# EAGLE design turbosound28p (EAGLE 9.3.1)
CNAME: Turbosound on DIP28; CREVISION: A; DESIGNER: Andy Karpov
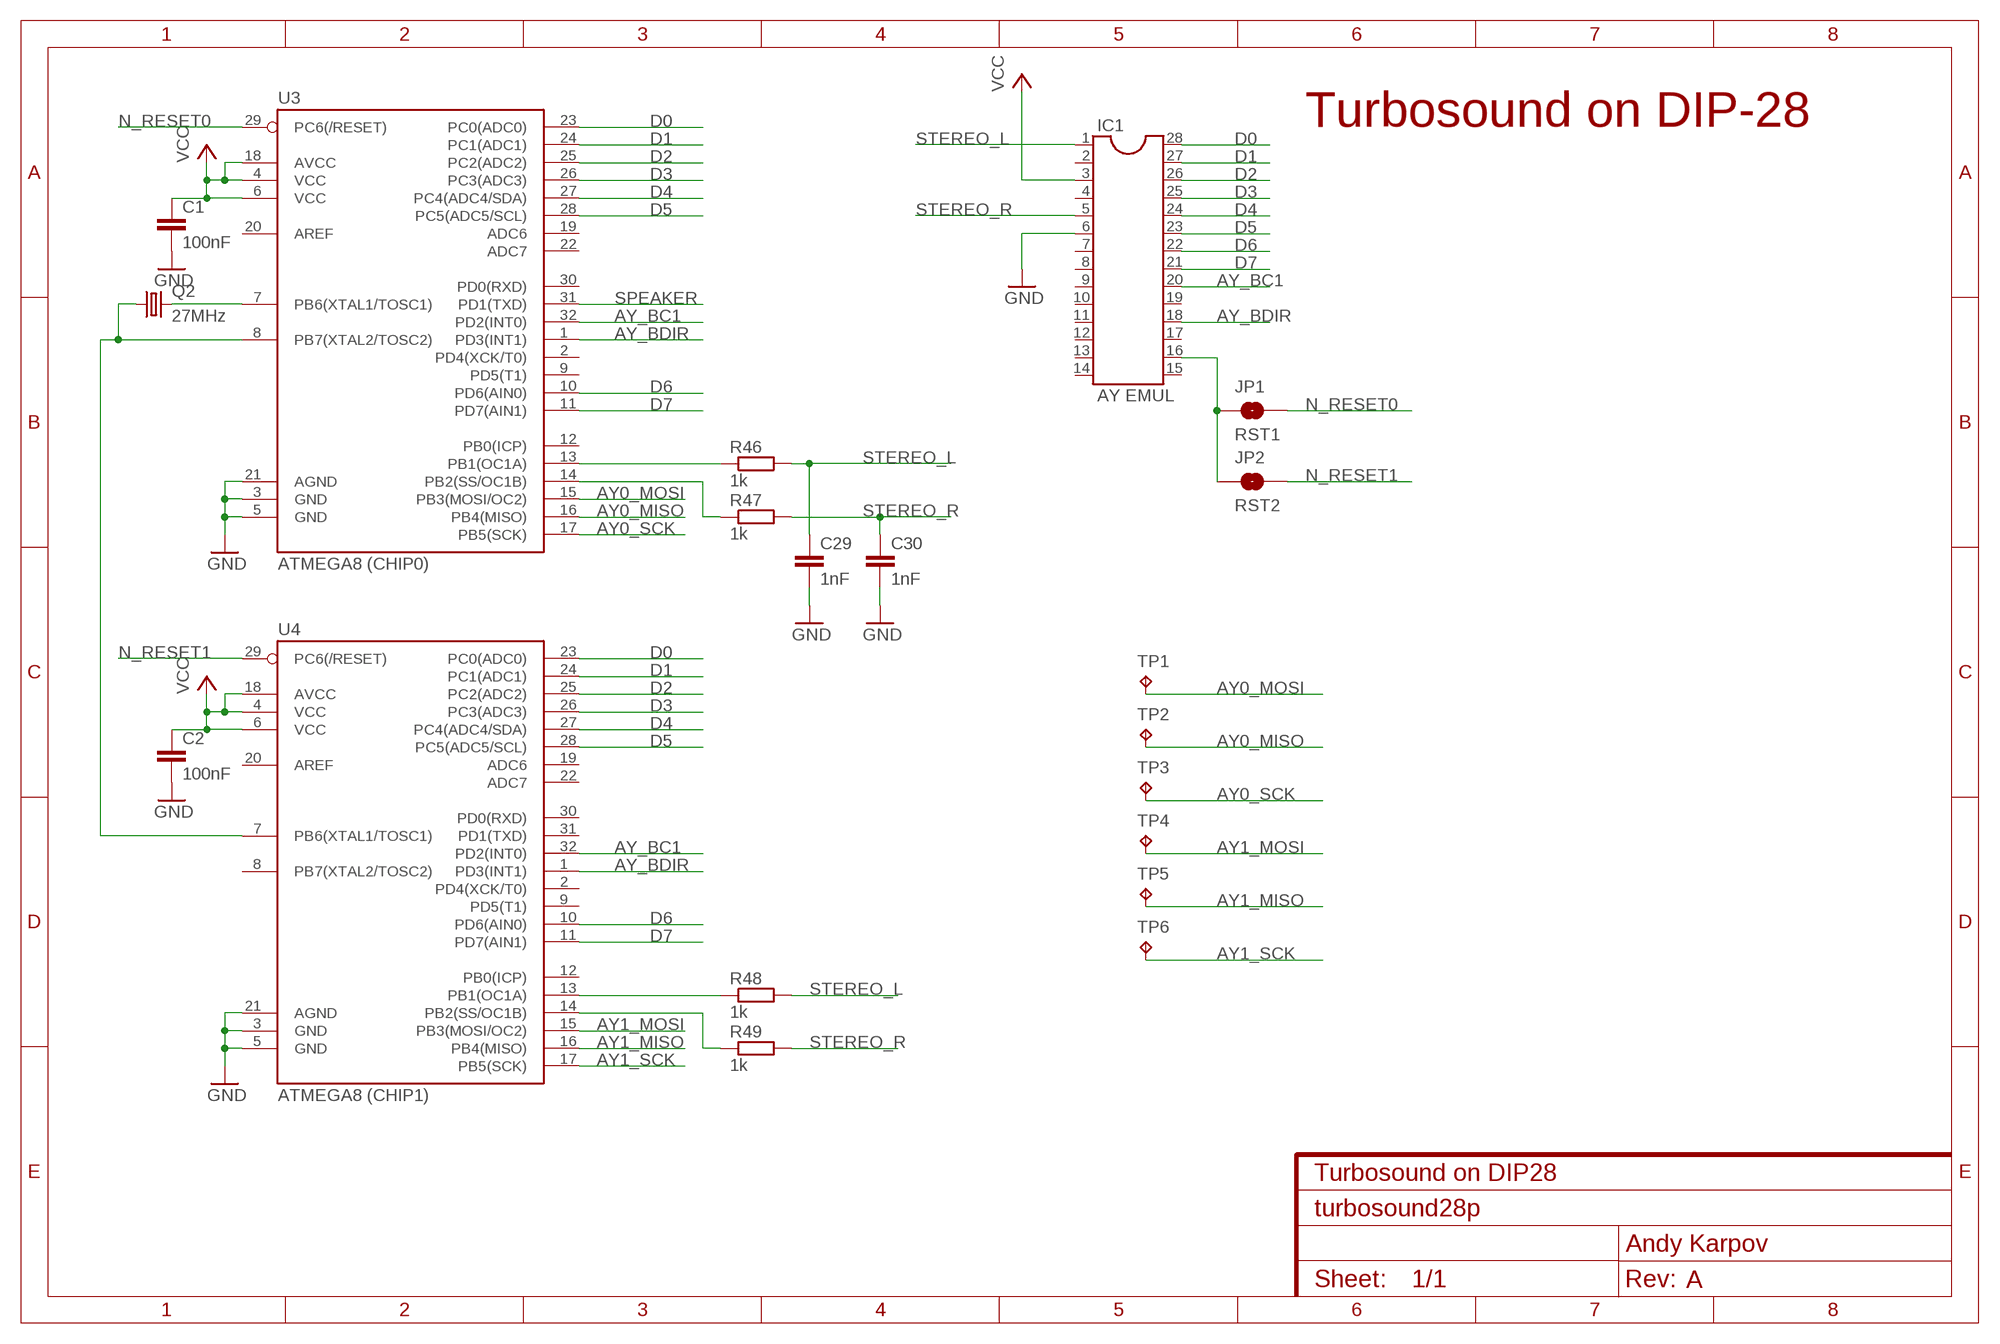
[diagram p0: schematic, sheet 1]

## Parts
C1  100nF  C-EUC0805  [C0805]
C2  100nF  C-EUC0805  [C0805]
C29  1nF  C-EUC0805  [C0805]
C30  1nF  C-EUC0805  [C0805]
IC1  AY EMUL  DIL28  [DIL28-6]
JP1  RST1  JUMPER-SMT_2_NO_SILK  [SMT-JUMPER_2_NO_SILK]
JP2  RST2  JUMPER-SMT_2_NO_SILK  [SMT-JUMPER_2_NO_SILK]
Q2  27MHz  CRYSTALHC49S  [HC49/S]
R46  1k  R-EU_R0805  [R0805]
R47  1k  R-EU_R0805  [R0805]
R48  1k  R-EU_R0805  [R0805]
R49  1k  R-EU_R0805  [R0805]
TP1  TPB1,27  [B1,27]
TP2  TPB1,27  [B1,27]
TP3  TPB1,27  [B1,27]
TP4  TPB1,27  [B1,27]
TP5  TPB1,27  [B1,27]
TP6  TPB1,27  [B1,27]
U3  ATMEGA8 (CHIP0)  ATMEGA328P_TQFP  [TQFP32-08]
U4  ATMEGA8 (CHIP1)  ATMEGA328P_TQFP  [TQFP32-08]

## Nets
AY0_MISO: TP2.TP U3.16(PB4(MISO))
AY0_MOSI: TP1.TP U3.15(PB3(MOSI/OC2))
AY0_SCK: TP3.TP U3.17(PB5(SCK))
AY1_MISO: TP5.TP U4.16(PB4(MISO))
AY1_MOSI: TP4.TP U4.15(PB3(MOSI/OC2))
AY1_SCK: TP6.TP U4.17(PB5(SCK))
AY_BC1: IC1.20 U3.32(PD2(INT0)) U4.32(PD2(INT0))
AY_BDIR: IC1.18 U3.1(PD3(INT1)) U4.1(PD3(INT1))
D0: IC1.28 U3.23(PC0(ADC0)) U4.23(PC0(ADC0))
D1: IC1.27 U3.24(PC1(ADC1)) U4.24(PC1(ADC1))
D2: IC1.26 U3.25(PC2(ADC2)) U4.25(PC2(ADC2))
D3: IC1.25 U3.26(PC3(ADC3)) U4.26(PC3(ADC3))
D4: IC1.24 U3.27(PC4(ADC4/SDA)) U4.27(PC4(ADC4/SDA))
D5: IC1.23 U3.28(PC5(ADC5/SCL)) U4.28(PC5(ADC5/SCL))
D6: IC1.22 U3.10(PD6(AIN0)) U4.10(PD6(AIN0))
D7: IC1.21 U3.11(PD7(AIN1)) U4.11(PD7(AIN1))
GND [power]: C1.2 C2.2 C29.2 C30.2 IC1.6 U3.3(GND) U3.5(GND) U3.21(AGND) U4.3(GND) U4.5(GND) U4.21(AGND)
N$1: IC1.16 JP1.1 JP2.1
N$5: R46.1 U3.13(PB1(OC1A))
N$7: R47.1 U3.14(PB2(SS/OC1B))
N$8: Q2.2 U3.7(PB6(XTAL1/TOSC1))
N$9: Q2.1 U3.8(PB7(XTAL2/TOSC2)) U4.7(PB6(XTAL1/TOSC1))
N$10: R48.1 U4.13(PB1(OC1A))
N$11: R49.1 U4.14(PB2(SS/OC1B))
N_RESET0: JP1.2 U3.29(PC6(/RESET))
N_RESET1: JP2.2 U4.29(PC6(/RESET))
SPEAKER: U3.31(PD1(TXD))
STEREO_L: C29.1 IC1.1 R46.2 R48.2
STEREO_R: C30.1 IC1.5 R47.2 R49.2
VCC [power]: C1.1 C2.1 IC1.3 U3.4(VCC) U3.6(VCC) U3.18(AVCC) U4.4(VCC) U4.6(VCC) U4.18(AVCC)
Unconnected: IC1.2 IC1.4 IC1.7 IC1.8 IC1.9 IC1.10 IC1.11 IC1.12 IC1.13 IC1.14 IC1.15 IC1.17 IC1.19 U3.2(PD4(XCK/T0)) U3.9(PD5(T1)) U3.12(PB0(ICP)) U3.19(ADC6) U3.20(AREF) U3.22(ADC7) U3.30(PD0(RXD)) U4.2(PD4(XCK/T0)) U4.8(PB7(XTAL2/TOSC2)) U4.9(PD5(T1)) U4.12(PB0(ICP)) U4.19(ADC6) U4.20(AREF) U4.22(ADC7) U4.30(PD0(RXD)) U4.31(PD1(TXD))

## Notes on the sheet
- Turbosound on DIP-28

## Library data of the parts
C1 C2 C29 C30 = karabas_box:C-EU: CAPACITOR, European symbol
IC1 = ic-package:DIL28: Dual In Line
JP1 JP2 = SparkFun-Jumpers:JUMPER-SMT_2_NO: Normally open jumper This jumper has two pads in close proximity to each other. Apply solder to close the connection. Round pads are easier to solder for beginners, but are a lot larger. SparkFun Product that uses the round pads: SparkFun EL Sequencer <https://www.sparkfun.com/products/12781>
Q2 = karabas_box:CRYSTAL: CRYSTAL; OC_FARNELL: 1667008; OC_NEWARK: unknown
R46-R49 = karabas_box:R-EU_: RESISTOR, European symbol
TP1-TP6 = testpad:TP: Test pad
U3 U4 = SparkFun-IC-Microcontroller:ATMEGA328P_TQFP: Popular 328P in QFP Storefront component: ATmega328 - TQFP <https://www.sparkfun.com/products/13448> (COM-13448) Datasheet <http://www.sparkfun.com/datasheets/Components/SMD/ATMega328.pdf> SparkFun Products SparkFun RedBoard - Programmed with Arduino <https://www.sparkfun.com/products/12757> (DEV-12757) Arduino Pro Mini 328 - 5V/16MHz <https://www.sparkfun.com/products/11113> (DEV-11113) Arduino Pro Mini 328 - 3.3V/8MHz <https://www.sparkfun.com/products/11114> (DEV-11114) SparkFun OpenLog <https://www.sparkfun.com/products/13712> (DEV-13712) SparkFun MicroView - OLED Arduino Module <https://www.sparkfun.com/products/12923> (DEV-12923) SparkFun Digital Sandbox <https://www.sparkfun.com/products/12651> (DEV-12651) SparkFun PicoBoard <https://www.sparkfun.com/products/11888> (WIG-11888) Arduino Fio <https://www.sparkfun.com/products/10116> (DEV-10116) LilyPad Arduino 328 Main Board <https://www.sparkfun.com/products/13342> (DEV-13342) SparkFun RedStick <https://www.sparkfun.com/products/13741> (DEV-13741) LilyPad MP3 <https://www.sparkfun.com/products/11013> (DEV-11013) LilyPad Arduino SimpleSnap <https://www.sparkfun.com/products/10941> (DEV-10941) SparkFun Stepoko <https://www.sparkfun.com/products/13899> (ROB-13899) SparkFun Geiger Counter <https://www.sparkfun.com/products/11345> (SEN-11345) SparkFun EL Sequencer <https://www.sparkfun.com/products/12781> (COM-12781) Arduino Pro 328 - 5V/16MHz <https://www.sparkfun.com/products/10915> (DEV-10915) CryptoCape <https://www.sparkfun.com/products/12773> (DEV-12773) SparkFun IR Thermometer Evaluation Board - MLX90614 <https://www.sparkfun.com/products/10740> (SEN-10740) SparkFun RedBot Mainboard <https://www.sparkfun.com/products/12097> (ROB-12097) Arduino Pro 328 - 3.3V/8MHz <https://www.sparkfun.com/products/10914> (DEV-10914) SparkFun Block for Intel® Edison - Arduino <https://www.sparkfun.com/products/13036> (DEV-13036) SparkFun Simon Says - Surface Mount Soldering Kit <https://www.sparkfun.com/products/10935> (KIT-10935) SparkFun 7-Segment Serial Display - Red <https://www.sparkfun.com/products/11441> (COM-11441) SparkFun 7-Segment Serial Display - White <https://www.sparkfun.com/products/11629> (COM-11629) SparkFun 7-Segment Serial Display - Yellow <https://www.sparkfun.com/products/11443> (COM-11443) SparkFun 7-Segment Serial Display - Kelly Green <https://www.sparkfun.com/products/11440> (COM-11440) SparkFun 7-Segment Serial Display - Blue <https://www.sparkfun.com/products/11442> (COM-11442) SparkFun OpenSegment Serial Display - 20mm (Blue) <https://www.sparkfun.com/products/11647> (COM-11647) SparkFun OpenSegment Serial Display - 20mm (Green) <https://www.sparkfun.com/products/11646> (COM-11646) SparkFun OpenSegment Serial Display - 20mm (White) <https://www.sparkfun.com/products/11648> (COM-11648) SparkFun OpenSegment Serial Display - 20mm (Red) <https://www.sparkfun.com/products/11644> (COM-11644) SparkFun OpenSegment Serial Display - 20mm (Yellow) <https://www.sparkfun.com/products/11645> (COM-11645) SparkFun OpenSegment Shield <https://www.sparkfun.com/products/13190> (DEV-13190); PROD_ID: IC-09069; VALUE: ATMEGA328P_TQFP

## Net classes
0 default: width 0.178 mm, clearance 0.178 mm
1 power: width 0.305 mm, clearance 0.178 mm to class 0, clearance 0.229 mm

## Board
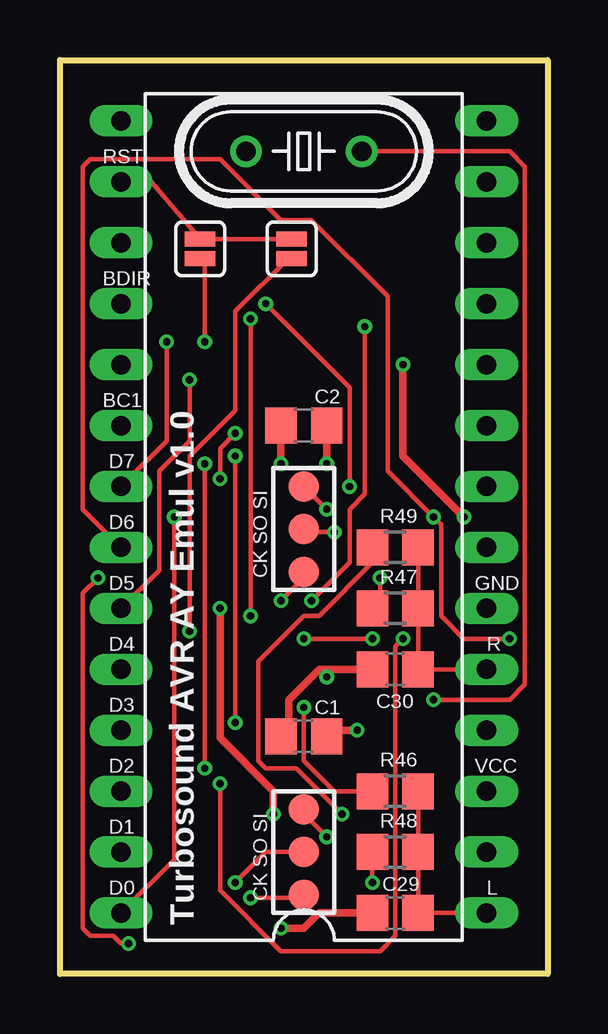
[diagram p1: board, top side]
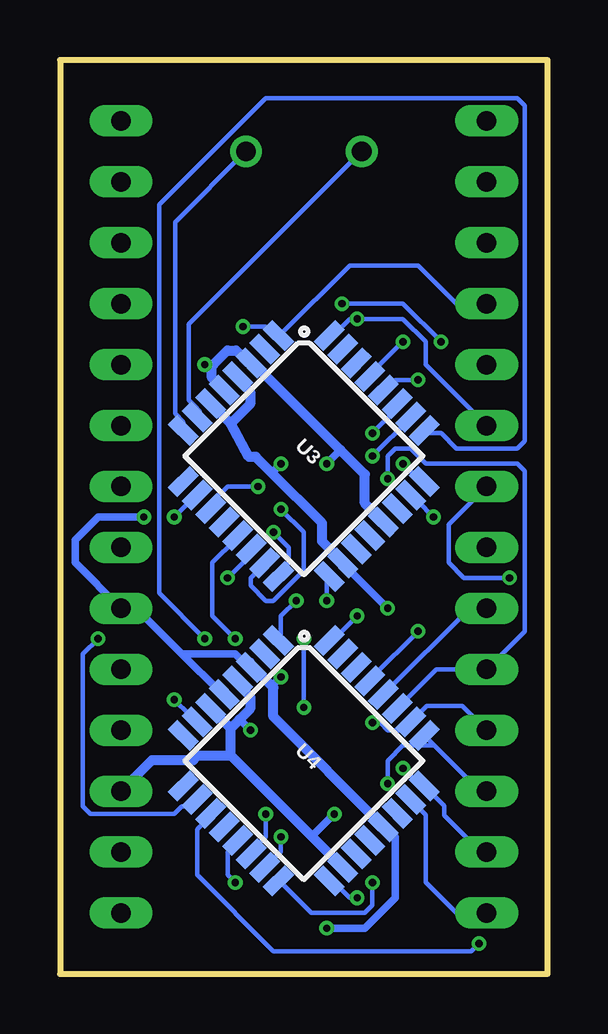
[diagram p2: board, bottom side, seen from below]

Size 20.32 x 38.1 mm. Coordinates in mm from the lower left corner, seen from the top.
Outline: 0,38.1 20.32,38.1 20.32,0 0,0 0,38.1
Copper layers (1*16): Top 0.035mm / dielectric 1.5mm / Bottom 0.035mm
Design rules "default": minimum track width 6mil, minimum drill 12mil, track to track 6mil, track to pad 6mil, pad to pad 6mil, via to via 6mil, smd to smd 0mil, copper to edge 10mil, drill to drill 10mil, minimum pad ring 10mil, minimum via ring 6mil, stop-mask expansion 2mil, vias tented up to drill 100mil, thermal gap 10mil

### Footprints (pad centres in the part's own frame; a part is rotated, then mirrored left to right if it is on the bottom)
C0805 = smd 1.3 x 1.5: 1 -0.95,0; 2 0.95,0
DIL28-6 = drill 0.813 long: 1 -16.51,-7.62; 2 -13.97,-7.62; 3 -11.43,-7.62; 4 -8.89,-7.62; 5 -6.35,-7.62; 6 -3.81,-7.62; 7 -1.27,-7.62; 8 1.27,-7.62; 9 3.81,-7.62; 10 6.35,-7.62; 11 8.89,-7.62; 12 11.43,-7.62; 13 13.97,-7.62; 14 16.51,-7.62; 15 16.51,7.62; 16 13.97,7.62; 17 11.43,7.62; 18 8.89,7.62; 19 6.35,7.62; 20 3.81,7.62; 21 1.27,7.62; 22 -1.27,7.62; 23 -3.81,7.62; 24 -6.35,7.62; 25 -8.89,7.62; 26 -11.43,7.62; 27 -13.97,7.62; 28 -16.51,7.62
SMT-JUMPER_2_NO_SILK = smd 0.635 x 1.27: 1 -0.406,0; 2 0.406,0
HC49/S = drill 0.813: 1 -2.413,0; 2 2.413,0
R0805 = smd 1.3 x 1.5: 1 -0.95,0; 2 0.95,0
B1,27 = smd 1.27 x 1.27: TP 0,0
TQFP32-08 = smd 1.27 x 0.559: 1 -4.293,2.8; 2 -4.293,2; 3 -4.293,1.2; 4 -4.293,0.4; 5 -4.293,-0.4; 6 -4.293,-1.2; 7 -4.293,-2; 8 -4.293,-2.8; 17 4.293,-2.8; 18 4.293,-2; 19 4.293,-1.2; 20 4.293,-0.4; 21 4.293,0.4; 22 4.293,1.2; 23 4.293,2; 24 4.293,2.8 | smd 0.559 x 1.27: 9 -2.8,-4.293; 10 -2,-4.293; 11 -1.2,-4.293; 12 -0.4,-4.293; 13 0.4,-4.293; 14 1.2,-4.293; 15 2,-4.293; 16 2.8,-4.293; 25 2.8,4.293; 26 2,4.293; 27 1.2,4.293; 28 0.4,4.293; 29 -0.4,4.293; 30 -1.2,4.293; 31 -2,4.293; 32 -2.8,4.293

### Placement (x,y rotation side)
C1  10.16,9.91 180 top
C2  10.16,22.86 180 top
C29  13.97,2.54 180 top
C30  13.97,12.7 180 top
IC1  10.16,19.05 90 top
JP1  5.84,30.23 270 top
JP2  9.65,30.23 270 top
Q2  10.16,34.29 180 top
R46  13.97,7.62 0 top
R47  13.97,15.24 0 top
R48  13.97,5.08 0 top
R49  13.97,17.78 0 top
TP1  10.16,20.32 0 top
TP2  10.16,18.54 0 top
TP3  10.16,16.76 0 top
TP4  10.16,6.86 0 top
TP5  10.16,5.08 0 top
TP6  10.16,3.3 0 top
U3  10.16,21.59 315 bottom
U4  10.16,8.89 315 bottom

### Tracks (layer width: path | path; a pad name or v marks a point on that pad's centre or on a via)
AY0_MISO  (via drill 0.3)
  Top 0.178: v11.43,18.41 10.16,18.41 TP2.TP
  Bottom 0.178: v11.43,18.41 10.79,17.78 10.79,17.14 11.11,16.83 U3.16
AY0_MOSI  (via drill 0.3)
  Top 0.178: v11.11,19.37 TP1.TP
  Bottom 0.178: v11.11,19.37 10.16,18.41 10.16,16.83 11.43,15.56 11.75,15.56 12.38,16.19 12.38,16.51 12.06,16.83 U3.15
AY0_SCK  (via drill 0.3)
  Top 0.178: v9.21,15.56 10.16,16.51 TP3.TP
  Bottom 0.178: v9.21,15.56 9.21,16.51 U3.17
AY1_MISO  (via drill 0.3)
  Top 0.178: TP5.TP 8.57,5.08 v7.3,3.81
  Bottom 0.178: v7.3,3.81 7.3,2.86 7.62,2.54 9.84,2.54 11.11,3.81 U4.16
AY1_MOSI  (via drill 0.3)
  Top 0.178: v11.11,5.71 10.16,6.67 TP4.TP
  Bottom 0.178: v11.11,5.71 11.11,5.08 11.75,4.45 U4.15
AY1_SCK  (via drill 0.3)
  Top 0.178: v7.94,3.17 10.16,3.17 TP6.TP
  Bottom 0.178: v7.94,3.17 8.26,3.17 8.89,3.81 U4.17
AY_BC1  (via drill 0.3)
  Top 0.178: v7.94,27.3 v7.94,14.92
  Bottom 0.178: v7.94,14.92 8.89,13.97 U4.32 | U3.32 8.89,26.67 8.26,27.3 v7.94,27.3 6.03,27.3 5.08,26.35 5.08,25.4 IC1.20
AY_BDIR  (via drill 0.3)
  Top 0.178: v10.48,15.56 12.06,17.14 12.06,19.37 12.7,20 v12.7,26.99
  Bottom 0.178: v10.48,15.56 11.11,14.92 11.11,13.97 U4.1 | v12.7,26.99 11.75,26.99 11.43,26.67 U3.1 11.11,26.67 8.26,29.53 5.4,29.53 3.81,27.94 IC1.18
D0  (via drill 0.3)
  Top 0.178: v4.76,19.05 4.76,4.76 IC1.28
  Bottom 0.178: U4.23 5.08,6.64 5.08,3.81 3.81,2.54 IC1.28 | v4.76,19.05 5.4,19.68 U3.23
D1  (via drill 0.3)
  Top 0.178: v6.03,8.57 v6.03,21.27
  Bottom 0.178: IC1.27 2.79,5.08 4.32,6.6 4.32,7.01 U4.24 5.4,7.94 v6.03,8.57 | v6.03,21.27 5.4,20.64 U3.24
D2  (via drill 0.3)
  Top 0.178: v14.29,13.97 13.97,13.65 13.97,1.59 13.34,0.95 9.21,0.95 6.67,3.49 v6.67,7.94
  Bottom 0.178: U4.25 4.74,9.54 | 4.74,9.54 2.82,7.62 IC1.26 | v14.29,13.97 16.19,15.88 16.19,32.07 11.75,36.51 1.27,36.51 0.95,36.2 0.95,22.23 1.27,21.91 3.81,21.91 4.45,22.54 5.08,22.54 U3.25 | v6.67,7.94 6.67,8.89 6.03,9.53 4.76,9.53 4.74,9.54
D3  (via drill 0.3)
  Top 0.178: v7.3,10.48 v7.3,21.59
  Bottom 0.178: IC1.25 3.56,11.18 5.05,11.18 U4.26 5.71,10.48 6.03,10.16 6.67,10.16 6.99,10.48 v7.3,10.48 | v7.3,21.59 5.71,23.18 U3.26
D4  (via drill 0.3)
  Top 0.178: v7.3,22.54 6.67,21.91 v6.67,20.64
  Bottom 0.178: U4.27 4.65,12.7 IC1.24 0.95,14.29 0.95,20.95 1.27,21.27 5.08,21.27 5.71,21.91 6.35,21.91 6.67,21.59 v6.67,20.64 | v7.3,22.54 6.35,23.5 U3.27
D5  (via drill 0.3)
  Top 0.178: v5.4,24.77 5.4,22.23 4.13,20.95 4.13,16.83 IC1.23
  Bottom 0.178: U4.28 3.24,15.24 IC1.23 | v5.4,24.77 6.35,24.77 6.67,24.45 U3.28
D6  (via drill 0.3)
  Top 0.178: v18.73,13.97 16.83,13.97 15.88,14.92 15.88,18.73 v15.56,19.05 13.65,20.95 13.65,28.26 10.48,31.43 9.21,31.43 6.67,33.97 1.27,33.97 0.95,33.66 0.95,19.37 IC1.22
  Bottom 0.178: v18.73,13.97 19.37,13.34 19.37,6.99 19.05,6.67 15.56,6.67 15.24,6.99 14.92,6.99 U4.10 | v15.56,19.05 14.92,19.68 U3.10
D7  (via drill 0.3)
  Top 0.178: v2.86,1.27 2.54,1.27 2.22,1.59 1.27,1.59 0.95,1.91 0.95,15.88 v1.59,16.51 | v12.06,20.32 12.06,24.45 v8.57,27.94 | v4.45,26.35 4.45,22.23 IC1.21
  Bottom 0.178: v2.86,1.27 3.17,0.95 11.43,0.95 14.61,4.13 14.61,6.03 14.29,6.35 14.29,6.67 U4.11 | v1.59,16.51 3.49,16.51 4.13,17.14 4.13,18.73 IC1.21 | v12.06,20.32 13.34,20.32 13.97,19.68 U3.11 | v8.57,27.94 6.03,27.94 v4.45,26.35
GND  (via drill 0.3)
  Top 0.305: C30.2 11.11,12.7 | 11.11,12.7 10.79,12.7 9.53,11.43 9.53,10.16 C1.2 | C29.2 10.79,2.54 10.16,1.91 v9.21,1.91 | v11.11,12.38 11.11,12.7 | v9.21,21.27 C2.2 | v14.29,25.4 14.29,21.59 v16.83,19.05
  Bottom 0.305: v9.21,1.91 7.62,1.91 6.35,3.17 6.35,5.71 6.67,6.03 U4.21 | v11.11,12.38 11.43,12.06 11.43,11.94 | 8.64,21.84 v9.21,21.27 | 15.24,13.34 17.14,15.24 IC1.6 19.68,17.14 19.68,18.1 18.73,19.05 v16.83,19.05 | 15.24,13.34 13.65,11.75 U4.5 | v14.29,25.4 13.97,25.4 | 15.24,13.34 13.02,13.34 12.7,13.02 12.38,13.02 U4.3
  Bottom 0.406: U3.5 13.99,24.86 13.99,25.34 13.97,25.36 13.97,25.4 13.93,25.4 13.34,25.99 12.98,25.99 12.47,25.47 U3.3 12.27,25.47 8.64,21.84 7.62,20.83 7.62,19.62 U3.21 | U4.21 11.43,10.73 11.43,11.94 12.27,12.77 U4.3
N$1
  Top 0.178: IC1.16 3.81,33.02 JP1.1 JP2.1
N$5  (via drill 0.3)
  Top 0.178: v10.16,13.97 v13.02,13.97 | v10.16,11.11 10.16,8.89 11.43,7.62 R46.1
  Bottom 0.178: v13.02,13.97 13.97,14.92 13.97,17.14 13.02,18.1 U3.13 | v10.16,11.11 v10.16,13.97
N$7  (via drill 0.3)
  Top 0.178: v13.34,16.51 13.34,15.24 R47.1
  Bottom 0.178: v13.34,16.51 12.38,17.46 U3.14
N$8
  Bottom 0.178: 14.61,23.41 14.61,23.57 14.96,23.92 14.96,27.08 Q2.2
  Bottom 0.406: U3.7 14.61,23.41
N$9  (via drill 0.3)
  Top 0.178: v15.56,11.43 18.73,11.43 19.37,12.06 19.37,33.66 18.73,34.29 Q2.1
  Bottom 0.178: v15.56,11.43 14.92,10.79 U4.7 | U3.8 15.18,23 15.52,23.35 15.52,31.34 Q2.1
N$10  (via drill 0.3)
  Top 0.178: v13.02,3.81 R48.1
  Bottom 0.178: v13.02,3.81 13.34,4.13 13.34,5.08 13.02,5.4 U4.13
N$11  (via drill 0.3)
  Top 0.178: v11.75,6.67 9.84,8.57 8.57,8.57 8.26,8.89 8.26,13.02 10.16,14.92 10.79,14.92 13.02,17.14 R49.1
  Bottom 0.178: v11.75,6.67 11.75,5.71 12.06,5.4 12.06,5.08 U4.14
N_RESET0  (via drill 0.3)
  Top 0.178: v6.03,26.35 6.03,29.53 JP1.2
  Bottom 0.178: v6.03,26.35 7.3,25.08 U3.29
N_RESET1  (via drill 0.3)
  Top 0.178: v5.4,14.29 5.4,21.59 7.3,23.5 7.3,27.62 9.53,29.84 JP2.2
  Bottom 0.178: v5.4,14.29 7.3,12.38 U4.29
STEREO_L
  Top 0.178: R48.2 C29.1 | R48.2 R46.2 | R48.2 | C29.1 IC1.1 | C29.1
STEREO_R
  Top 0.178: R47.2 C30.1 | R47.2 R49.2 | R47.2 | C30.1 IC1.5 | C30.1
VCC  (via drill 0.3)
  Top 0.305: v12.38,10.16 11.11,10.16 C1.1 | v11.11,21.27 C2.1 | v8.89,6.67 8.89,7.62 6.67,9.84 v6.67,15.24
  Bottom 0.305: v12.38,10.16 12.7,10.48 12.84,10.61 | 11.49,20.89 v11.11,21.27 | v8.89,6.67 9.83,5.73 | v6.67,15.24 8.26,16.83 U3.18
  Bottom 0.406: U3.18 9.14,17.78 9.4,18.03 9.4,18.8 11.49,20.89 12.16,21.56 12.45,21.56 13.21,22.94 | 13.21,22.94 U3.6 | U3.4 12.91,24.78 12.4,24.27 12.4,23.75 13.21,22.94 | U4.18 9.83,5.73 13.21,9.11 | 13.21,10.24 U4.6 | 13.21,9.11 13.21,10.24 | U4.4 12.91,12.08 12.4,11.57 12.4,11.05 12.84,10.61 13.21,10.24 | 13.21,9.11 14.57,9.11 14.77,8.92 16.48,8.92 IC1.3

### Text on the board
tNames: RST | BDIR | BC1 | D7 | D6 | CK SO SI | D5 | GND | D4 | R | D3 | D2 | VCC | D1 | D0 | CK SO SI | L | Turbosound AVR AY Emul v1.0